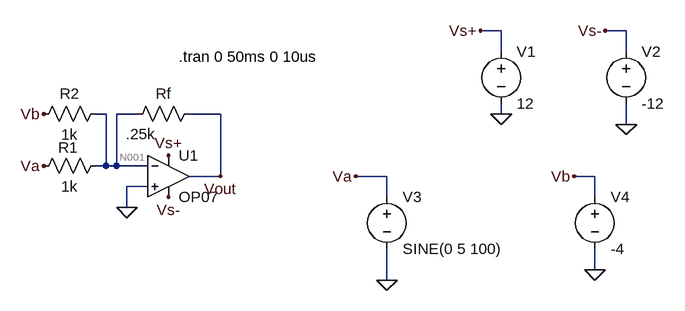
[diagram p0: schematic Task03.asc]
Task03.asc, the LTspice schematic file:
Version 4
SHEET 1 880 680
WIRE 352 -128 320 -128
WIRE 544 -128 512 -128
WIRE 352 -96 352 -128
WIRE 544 -96 544 -128
WIRE -256 0 -272 0
WIRE -208 0 -240 0
WIRE -80 0 -128 0
WIRE 352 0 352 -16
WIRE 544 16 544 -16
WIRE -256 80 -256 0
WIRE -256 80 -272 80
WIRE -240 80 -240 0
WIRE -240 80 -256 80
WIRE -192 80 -240 80
WIRE -80 96 -80 0
WIRE -80 96 -128 96
WIRE 176 96 128 96
WIRE 496 96 464 96
WIRE -192 112 -224 112
WIRE 176 128 176 96
WIRE 496 128 496 96
WIRE -224 144 -224 112
WIRE 496 240 496 208
WIRE 176 256 176 208
FLAG -224 144 0
FLAG -352 80 Va
FLAG -160 64 Vs+
FLAG -160 128 Vs-
FLAG 352 0 0
FLAG 544 16 0
FLAG 176 256 0
FLAG 320 -128 Vs+
FLAG 128 96 Va
FLAG 512 -128 Vs-
FLAG -80 96 Vout
FLAG -352 0 Vb
FLAG 496 240 0
FLAG 464 96 Vb
SYMBOL res -368 96 R270
WINDOW 0 29 54 VTop 2
WINDOW 3 0 56 VBottom 2
SYMATTR InstName R1
SYMATTR Value 1k
SYMBOL res -224 16 R270
WINDOW 0 32 56 VTop 2
WINDOW 3 1 21 VBottom 2
SYMATTR InstName Rf
SYMATTR Value .25k
SYMBOL OpAmps\\OP07 -160 32 R0
SYMATTR InstName U1
SYMBOL voltage 352 -112 R0
SYMATTR InstName V1
SYMATTR Value 12
SYMBOL voltage 544 -112 R0
SYMATTR InstName V2
SYMATTR Value -12
SYMBOL voltage 176 112 R0
WINDOW 123 0 0 Left 0
WINDOW 39 0 0 Left 0
SYMATTR InstName V3
SYMATTR Value SINE(0 5 100)
SYMBOL res -368 16 R270
WINDOW 0 32 56 VTop 2
WINDOW 3 0 56 VBottom 2
SYMATTR InstName R2
SYMATTR Value 1k
SYMBOL voltage 496 112 R0
SYMATTR InstName V4
SYMATTR Value -4
TEXT -144 -88 Left 2 !.tran 0 50ms 0 10us

The netlist it stands for:
* Task03.asc
R1 Va N001 1k
Rf N001 Vout .25k
XU1 0 N001 Vs+ Vs- Vout LT1001  ; OP07, pins In+ In- V+ V- OUT
V1 Vs+ 0 12
V2 Vs- 0 -12
V3 Va 0 SINE(0 5 100)
R2 Vb N001 1k
V4 Vb 0 -4
.tran 0 50ms 0 10us
.lib LTC.lib
.backanno
.end

* Results of the author's LTspice run, read from the files saved beside the schematic
* Operating Point, zero values left out:
*   V(n001) = -1.519 µV
*   V(vout) = 1 V
*   V(vs+) = 12 V
*   V(vs-) = -12 V
*   V(vb) = -4 V
*   I(R2) = -4 mA
*   I(Rf) = -4 mA
*   I(R1) = 1.519 nA
*   I(V4) = 4 mA
*   I(V3) = -1.519 nA
*   I(V2) = 694.4 µA
*   I(V1) = -4.694 mA
*   Ix(u1:3) = 4.694 mA
*   Ix(u1:4) = -694.4 µA
*   Ix(u1:5) = -4 mA
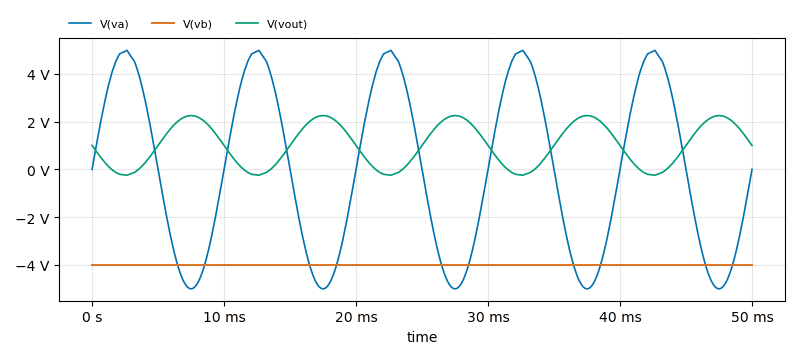
[diagram p1: Transient Analysis of Task03.asc, plotted from the saved traces]
* Transient Analysis, 1 run:
*   V(va): min -5 V, max 4.98 V, average -6.795 mV, rms 3.532 V, last 0 V
*   V(vb): min -4 V, max -4 V, average -4 V, rms 4 V, last -4 V
*   V(vout): min -244.9 mV, max 2.25 V, average 1.002 V, rms 1.335 V, last 1 V